# EAGLE design MirZ21 (EAGLE 9.6.2)
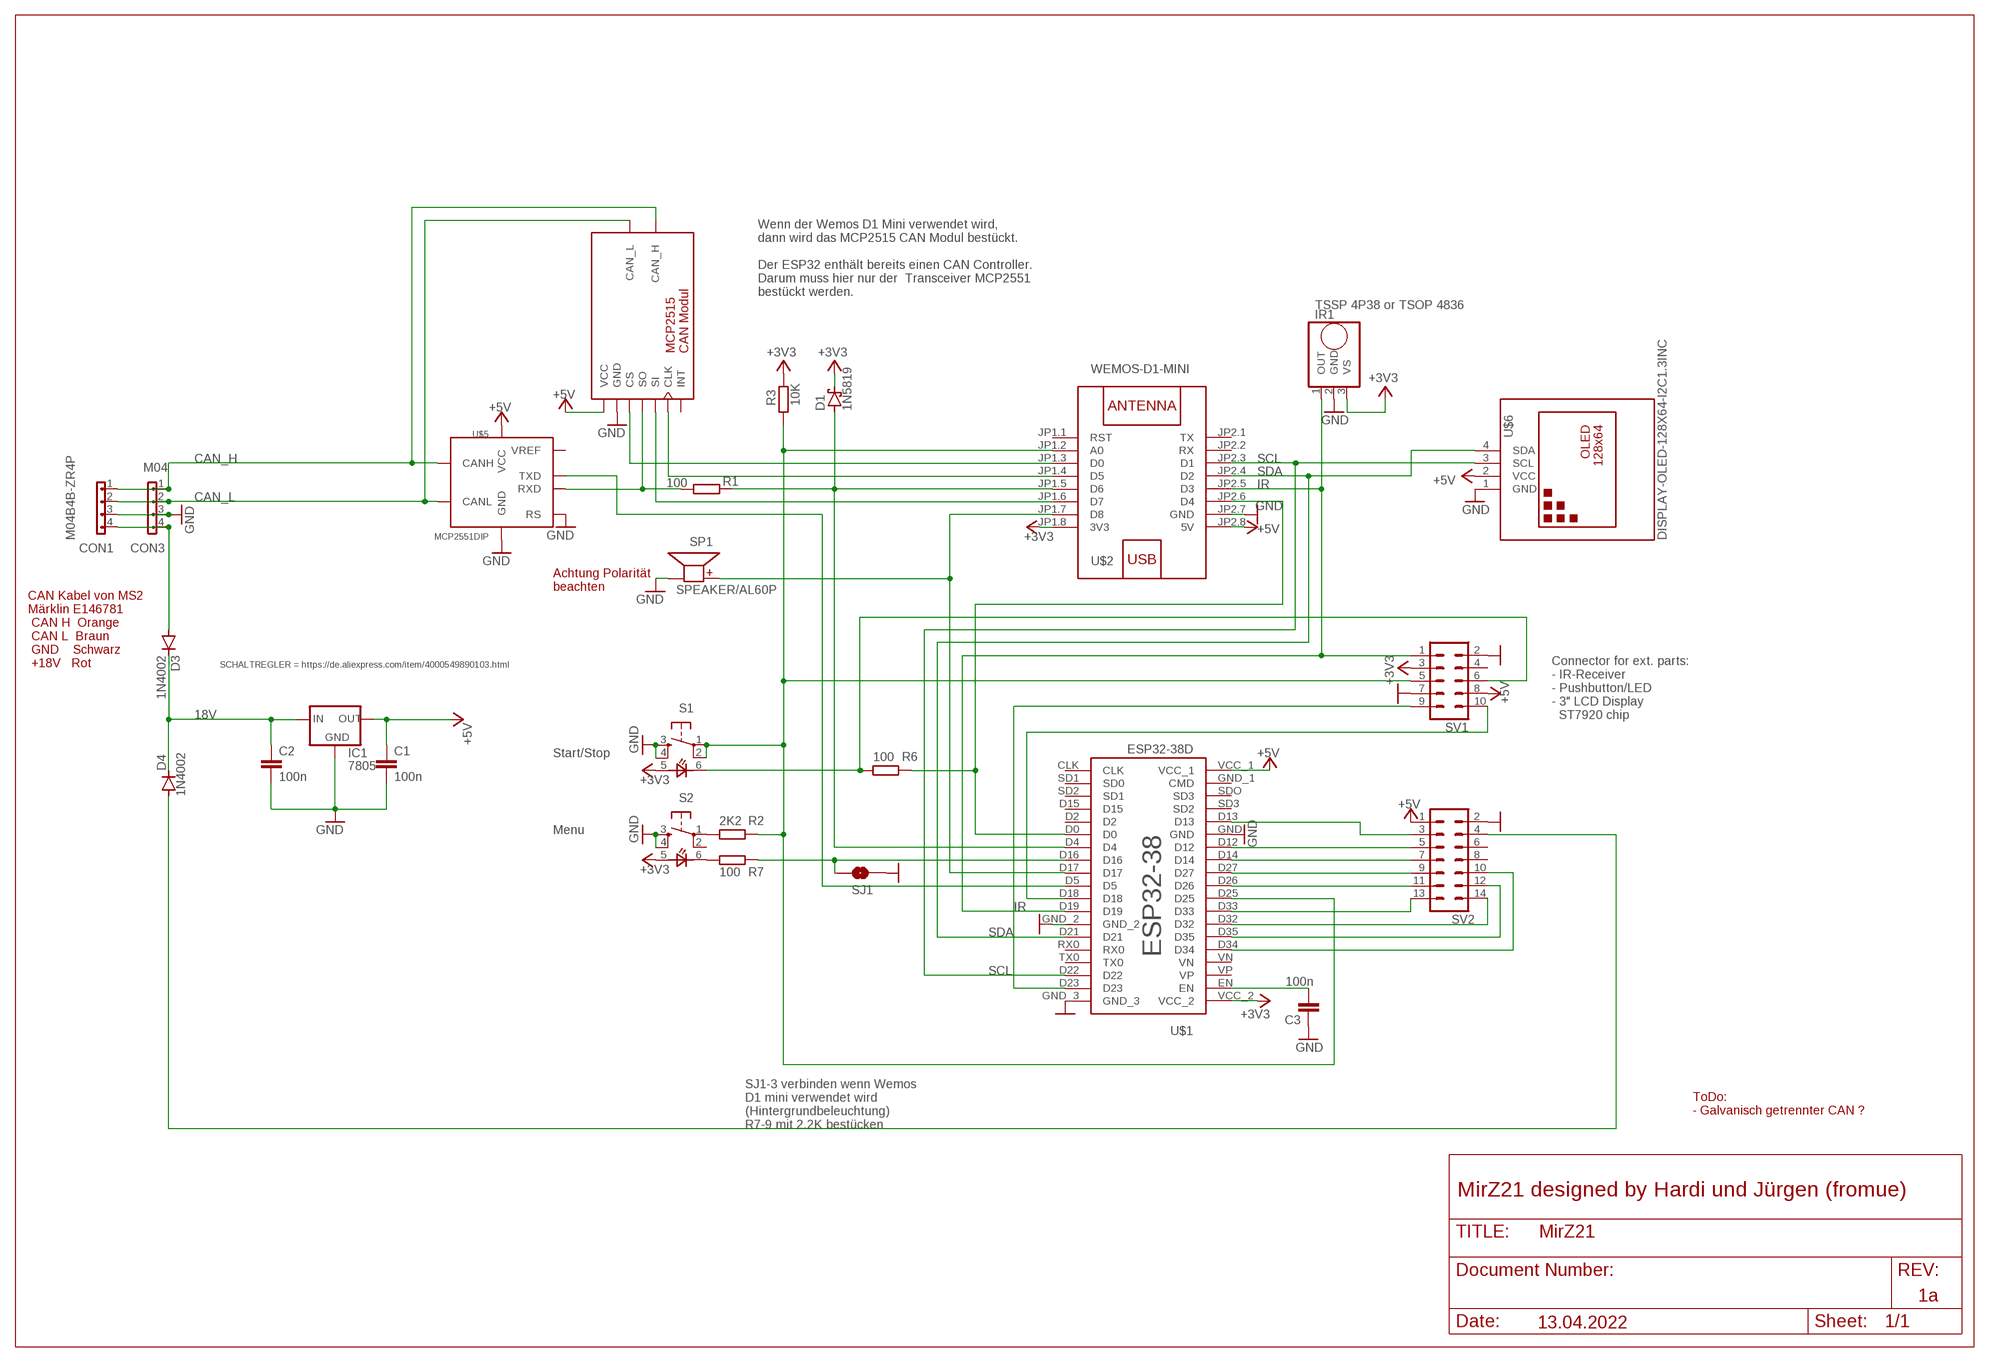
[diagram p0: schematic, sheet 1]

## Parts
C1  100n  C-EU025-025X050  [C025-025X050]
C2  100n  C-EU025-025X050  [C025-025X050]
C3  100n  C-EU025-025X050  [C025-025X050]
CAN1  MCP2515_CAN_CUTCUT  [MCP2515_CAN_CUT]
CON1  M04B4B-ZR4P  [B4B-ZR4P]
CON3  M04  [1X04]
D1  1N5819  1N581  [DO41-7.6]
D3  1N4002  1N4004  [DO41-10]
D4  1N4002  1N4004  [DO41-10]
IC1  7805  78XXSSTEPDOWN  [HX1314G]
IR1  TSSP 4P38 or TSOP 4836  TSSP4P38  [TSSP4P38]
R1  100  R0204/7  [0204/7]
R2  2K2  R0204/7  [0204/7]
R3  10K  R0204/7  [0204/7]
R6  100  R0204/7  [0204/7]
R7  100  R0204/7  [0204/7]
S1  TASTER_LEDTC-1198-B  [TASTER_LED]
S2  TASTER_LEDTC-1198-B  [TASTER_LED]
SJ1  SOLDERJUMPERNO  [SJ_2S-NO]
SP1  SPEAKER/AL60P  [RMP-14SP]
SV1  ML10  [ML10]
SV2  ML14  [ML14]
U$1  ESP32-38D  [ESP32-38D]
U$2  WEMOS-D1-MINI  [WEMOS-D1-MINI]
U$5  MCP2551DIP  [DIP08]
U$6  DISPLAY-OLED-128X64-I2C1.3INC  [DISPLAY-OLED-128X64-I2C-1.3]

## Nets
18V: C2.1 D3.C D4.C IC1.IN
+3V3: D1.C IR1.3(VS) R3.2 S1.5(+) S2.5(+) SV1.3 U$1.VCC_2 U$2.JP1.8(3V3)
+5V: C1.1 CAN1.1(VCC) IC1.OUT SV1.8 SV2.1 U$1.VCC_1 U$2.JP2.8(5V) U$5.3(VCC) U$6.2(VCC)
CAN_H: CAN1.9(CAN_H) CON1.1 CON3.1 U$5.7(CANH)
CAN_L: CAN1.8(CAN_L) CON1.2 CON3.2 U$5.6(CANL)
GND: C1.2 C2.2 C3.1 CAN1.2(GND) CON1.3 CON3.3 IC1.GND IR1.2(GND) S1.3(S) S1.4(S1) S2.3(S) S2.4(S1) SJ1.1 SP1.2(-) SV1.2 SV1.7 SV2.2 U$1.GND U$1.GND_2 U$1.GND_3 U$2.JP2.7(GND) U$5.2(GND) U$5.8(RS) U$6.1(GND)
IR: IR1.1(OUT) SV1.1 U$1.D19 U$2.JP2.5(D3)
N$1: CAN1.3(CS) U$2.JP1.3(D0)
N$2: CAN1.5(SI) U$2.JP1.6(D7)
N$3: D1.A R1.1 U$1.D4 U$2.JP1.5(D6)
N$4: R6.2 S1.6(-) SV1.6
N$5: CAN1.6(CLK) U$2.JP1.4(D5)
N$6: U$1.D5 U$5.1(TXD)
N$7: CAN1.4(SO) R1.2 U$5.4(RXD)
N$8: R7.2 S2.6(-)
N$9: C3.2 U$1.EN
N$10: R2.2 S2.1(P)
N$13: R6.1 U$1.D0 U$2.JP2.6(D4)
N$14: R2.1 R3.1 S1.1(P) S1.2(P1) SV1.5 U$1.D25 U$2.JP1.2(A0)
N$16: SP1.1(+) U$1.D17 U$2.JP1.7(D8)
N$20: R7.1 SJ1.2 U$1.D16
N$21: SV1.10 U$1.D18
N$22: SV1.9 U$1.D23
N$23: SV2.3 U$1.D13
N$24: SV2.5 U$1.D12
N$25: SV2.7 U$1.D14
N$26: SV2.9 U$1.D27
N$27: SV2.11 U$1.D26
N$28: SV2.13 U$1.D33
N$29: SV2.14 U$1.D32
N$30: SV2.12 U$1.D35
N$31: SV2.10 U$1.D34
N$34: D4.A SV2.4
N$35: CON1.4 CON3.4 D3.A
SCL: U$1.D22 U$2.JP2.3(D1) U$6.3(SCL)
SDA: U$1.D21 U$2.JP2.4(D2) U$6.4(SDA)
Unconnected: CAN1.7(INT) S2.2(P1) SV1.4 SV2.6 SV2.8 U$1.CLK U$1.D2 U$1.D15 U$1.GND_1(CMD) U$1.RX0 U$1.SD1(SD0) U$1.SD2(SD1) U$1.SD3(SD2) U$1.SDO(SD3) U$1.TX0 U$1.VN U$1.VP U$2.JP1.1(RST) U$2.JP2.1(TX) U$2.JP2.2(RX)

## Notes on the sheet
- Wenn der Wemos D1 Mini verwendet wird,
  dann wird das MCP2515 CAN Modul bestückt.
  
  Der ESP32 enthält bereits einen CAN Controller. 
  Darum muss hier nur der  Transceiver MCP2551
  bestückt werden.
- Achtung Polarität
  beachten
- CAN Kabel von MS2
  Märklin E146781
   CAN H  Orange   
   CAN L  Braun    
   GND    Schwarz  
   +18V   Rot
- Connector for ext. parts:
  - IR-Receiver
  - Pushbutton/LED
  - 3" LCD Display 
    ST7920 chip
- Start/Stop
- Menu
- SJ1-3 verbinden wenn Wemos
  D1 mini verwendet wird
  (Hintergrundbeleuchtung)
  R7-9 mit 2.2K bestücken
- ToDo:
  - Galvanisch getrennter CAN ?
- MirZ21 designed by Hardi und Jürgen (fromue)
- 1a
- 13.04.2022

## Power pins joined to a net without a drawn wire
VREF: U$5.5(VREF)

## Library data of the parts
C1-C3 = rcl:C-EU: CAPACITOR, European symbol
CAN1 = Arduino_fuer_LEDs_DCC_2_All:MCP2515_CAN_CUT: MCP2515 CAN Modul
CON1 CON3 = Connectors_Inline3_7:M04
D1 = diode:1N581*: 1.0A SCHOTTKY BARRIER RECTIFIER Source: http://www.diodes.com/datasheets/ds23001.pdf
D3 D4 = diode:1N4004: DIODE general purpose rectifier, 1 A
IC1 = v-reg:78XXS: VOLTAGE REGULATOR; SCHALTREGLER: https://de.aliexpress.com/item/4000549890103.html
IR1 = adafruit:TSSP4P38: TSSP 4P38
R1-R3 R6 R7 = Arduino_fuer_LEDs_DCC_2:R: RESISTOR, European symbol; SPICEMODEL: NONE; SPICEPREFIX: R
S1 S2 = switch-omron:TASTER_LED: OMRON SWITCH; ALI: https://de.aliexpress.com/item/4000415375387.html; ELV: 091576 EAN 4023392915765
SJ1 = SparkFun-Retired:SOLDERJUMPER: Solder Jumper Standard SMD solder jumper. Used to automate production. Two varients : Normally Open and Normally Closed are the same, but have different paste layers. NC will have a large amount of paste and should jumper during reflow.
SP1 = adafruit:SPEAKER: SPEAKER Source: Buerklin Added PS12 (for part # PS1240 piezo) http://www.ladyada.net/library/pcb/eaglelibrary.html
SV1 = con-harting-ml:ML10: HARTING; OC_FARNELL: unknown; OC_NEWARK: unknown
SV2 = Arduino_fuer_LEDs_DCC_2:ML14: HARTING; OC_FARNELL: unknown; OC_NEWARK: unknown
U$1 = MLL-Dominik-Hardi:ESP32-38
U$2 = diy-modules_modified_by_Hardi:WEMOS-D1-MINI: WEMOS D1 mini: Mini Wi-Fi Board based on ESP-8266 device More details can be found here: https://www.wemos.cc/product/d1-mini.html Click here to find device on ebay.com <http://www.ebay.com/sch/wemos+d1+mini+nodemcu>
U$5 = MLL-Dominik-Hardi:MCP2551
U$6 = diy-modules:DISPLAY-OLED-128X64-I2C: 128x64 Dot Matrix OLED Module based on SSD1306 chip Variant with I2C interface More details available here: http://www.instructables.com/id/Monochrome-096-i2c-OLED-display-with-arduino-SSD13/ SSD1306 datasheet: https://cdn-shop.adafruit.com/datasheets/SSD1306.pdf Click here to find device on ebay.com <http://www.ebay.com/sch/oled+display+128x64+iic> Note: There are two variants: I2C and SPI. Search for the proper version.

## Board
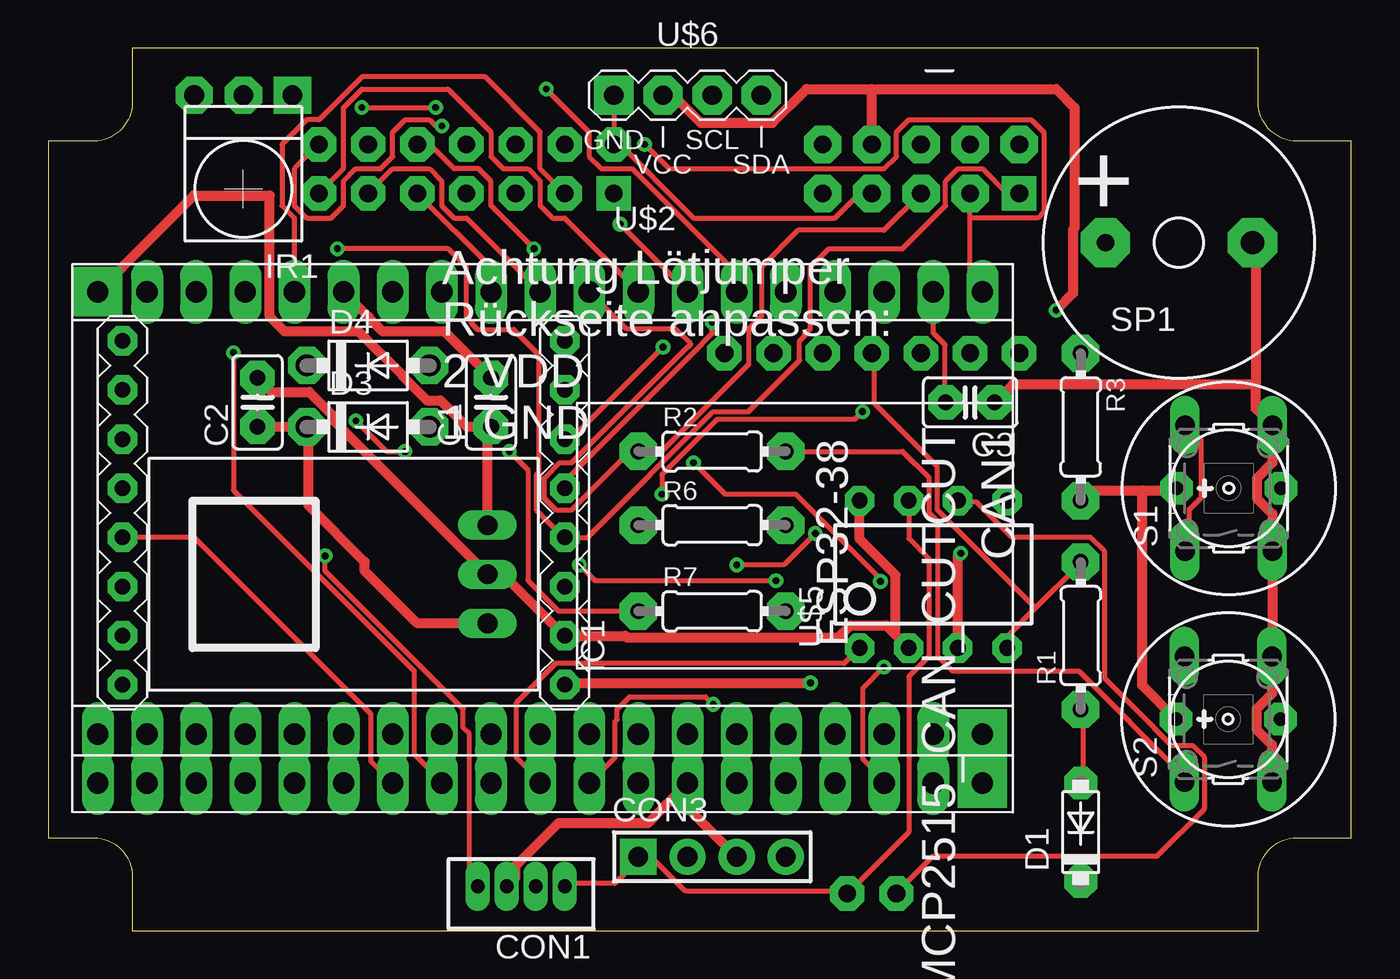
[diagram p1: board, top side]
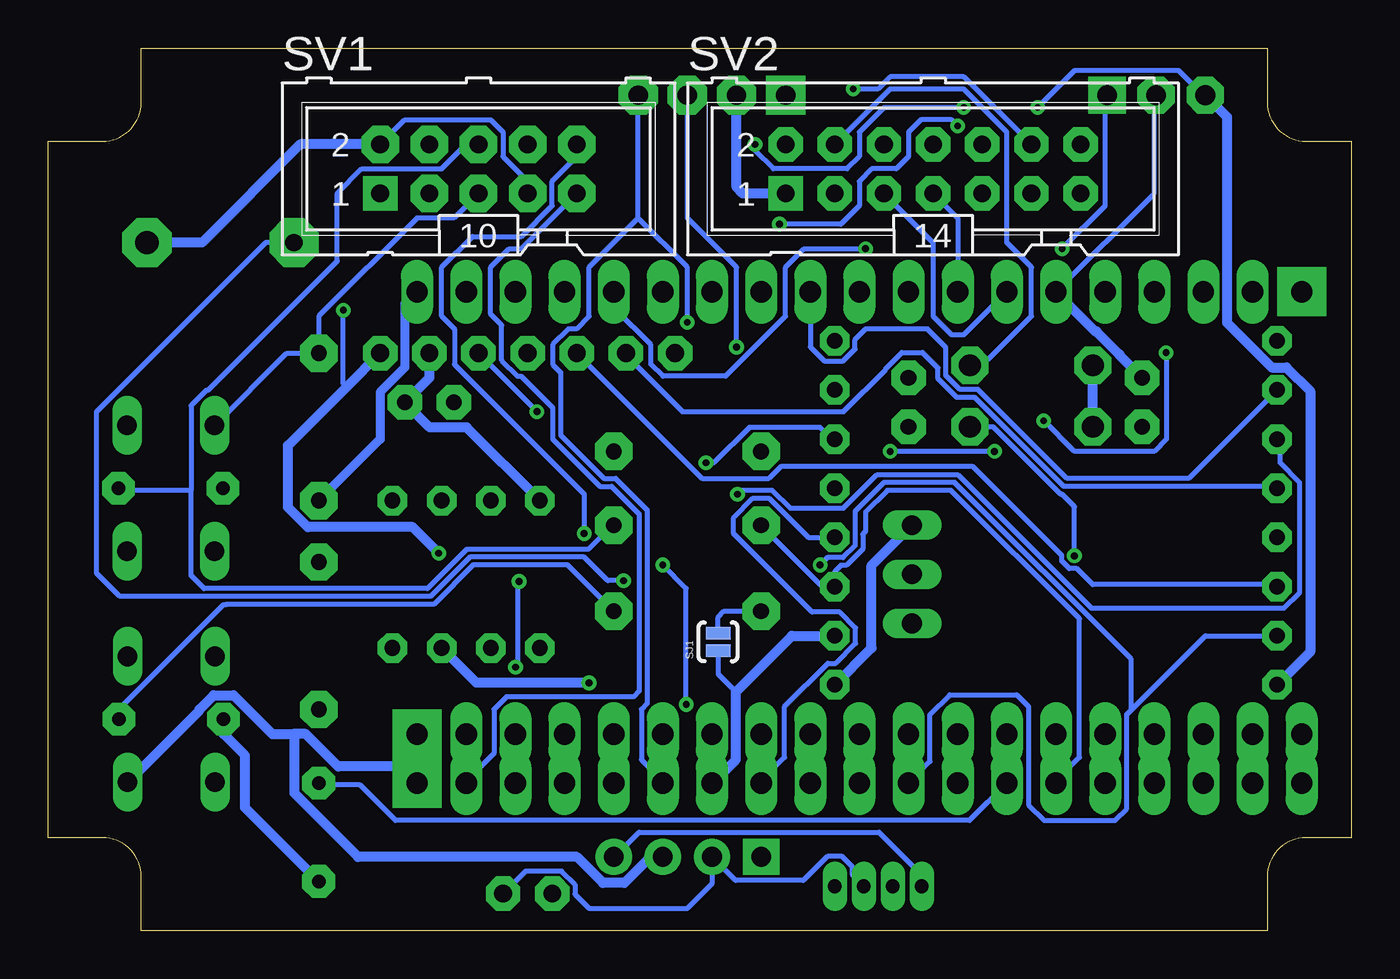
[diagram p2: board, bottom side, seen from below]

Size 67.33 x 45.6 mm. Coordinates in mm from the lower left corner, seen from the top.
Outline: 62.53,0 62.53,2.8 arc-90 64.53,4.8 67.33,4.8 67.33,40.8 64.53,40.8 arc-90 62.53,42.8 62.53,45.6 4.33,45.6 4.33,42.8 arc-90 2.33,40.8 0,40.8 0,4.8 2.33,4.8 arc-90 4.33,2.8 4.33,0 62.53,0
Copper layers (1*16): Top 0.035mm / dielectric 1.5mm / Bottom 0.035mm
Design rules "default *": minimum track width 6mil, minimum drill 0.35mm, track to track 6mil, track to pad 6mil, pad to pad 6mil, via to via 6mil, smd to smd 6mil, copper to edge 40mil, drill to drill 6mil, minimum pad ring 10mil, minimum via ring 8mil, stop-mask expansion 4mil, vias tented up to drill 0mil, thermal gap 10mil

### Footprints (pad centres in the part's own frame; a part is rotated, then mirrored left to right if it is on the bottom)
C025-025X050 = drill 0.813 pad 1.778 octagon: 1 -1.27,0; 2 1.27,0
MCP2515_CAN_CUT = drill 0.914 pad 1.778 octagon: 1 0,0; 2 0,-2.54; 3 0,-5.08; 4 0,-7.62; 5 0,-10.16; 6 0,-12.7; 7 0,-15.24; 8 27.94,-6.35; 9 27.94,-8.89
B4B-ZR4P = drill 0.7 pad 1.27 long: 1 0,0; 2 1.5,0; 3 3,0; 4 4.5,0
1X04 = drill 1.016 pad 1.88 square: 1 0,0 | drill 1.016 pad 1.88: 2 2.54,0; 3 5.08,0; 4 7.62,0
DO41-7.6 = drill 0.7 pad 1.7 octagon: A 2.54,0; C -2.54,0
DO41-10 = drill 1.118 pad 1.93 octagon: A 3.175,0; C -3.175,0
HX1314G = drill 1.016 long: GND 0,0; IN -2.54,0; OUT 2.54,0
TSSP4P38 = drill 1.016 pad 1.93 square: 1 -2.54,0 | drill 1.016 pad 1.93 octagon: 2 0,0; 3 2.54,0
0204/7 = drill 0.813 pad 1.93 octagon: 1 -3.81,0; 2 3.81,0
TASTER_LED = drill 1.016 long: 1 -3.251,2.261; 2 3.251,2.261; 3 -3.251,-2.261; 4 3.251,-2.261 | drill 0.7 pad 1.676 octagon: 5 0,2.7; 6 0,-2.7
SJ_2S-NO = smd 0.635 x 1.27: 1 -0.45,0; 2 0.45,0
RMP-14SP = drill 0.9 pad 2.54 octagon: 1 -3.8,0 | drill 1.2 pad 2.54 octagon: 2 3.8,0
ML10 = drill 0.914 pad 1.778 square: 1 -5.08,-1.27 | drill 0.914 pad 1.93 octagon: 2 -5.08,1.27; 3 -2.54,-1.27; 4 -2.54,1.27; 5 0,-1.27; 6 0,1.27; 7 2.54,-1.27; 8 2.54,1.27; 9 5.08,-1.27; 10 5.08,1.27
ML14 = drill 0.914 pad 1.778 square: 1 -7.62,-1.27 | drill 0.914 pad 1.778 octagon: 2 -7.62,1.27; 3 -5.08,-1.27; 4 -5.08,1.27; 5 -2.54,-1.27; 6 -2.54,1.27; 7 0,-1.27; 8 0,1.27; 9 2.54,-1.27; 10 2.54,1.27; 11 5.08,-1.27; 12 5.08,1.27; 13 7.62,-1.27; 14 7.62,1.27
ESP32-38D = drill 1.1 pad 1.45 long: CLK 25.4,0; CLK-1 22.86,0; D0 25.4,12.7; D0-1 22.86,12.7; D2 25.4,10.16; D2-0 22.86,10.16; D4 25.4,15.24; D4-1 22.86,15.24; D5 25.4,22.86; D5-1 22.86,22.86; D12 0,15.24; D13 0,10.16; D14 0,17.78; D15 25.4,7.62; D15-1 22.86,7.62; D16 25.4,17.78; D16-1 22.86,17.78; D17 25.4,20.32; D17-1 22.86,20.32; D18 25.4,25.4; D18-1 22.86,25.4; D19 25.4,27.94; D19-1 22.86,27.94; D21 25.4,33.02; D21-1 22.86,33.02; D22 25.4,40.64; D22-1 22.86,40.64; D23 25.4,43.18; D23-1 22.86,43.18; D25 0,25.4; D26 0,22.86; D27 0,20.32; D32 0,30.48; D33 0,27.94; D34 0,35.56; D35 0,33.02; EN 0,43.18; GND 0,12.7; GND_1 0,2.54; GND_2 25.4,30.48; GND_2-1 22.86,30.48; RX0 25.4,35.56; RX0-1 22.86,35.56; SD0-1 22.86,2.54; SD1 25.4,5.08; SD1-1 22.86,5.08; SD2 0,7.62; SD3 0,5.08; SDO 25.4,2.54; TX0 25.4,38.1; TX0-1 22.86,38.1; VCC_2 0,45.72; VN 0,38.1; VP 0,40.64 | drill 1.1 pad 2.54 square: GND_3 25.4,45.72; GND_3-1 22.86,45.72; VCC_1 0,0
WEMOS-D1-MINI = drill 0.8 pad 1.524 octagon: JP1.1 -11.43,9.525; JP1.2 -11.43,6.985; JP1.3 -11.43,4.445; JP1.4 -11.43,1.905; JP1.5 -11.43,-0.635; JP1.6 -11.43,-3.175; JP1.7 -11.43,-5.715; JP1.8 -11.43,-8.255; JP2.1 11.43,9.525; JP2.2 11.43,6.985; JP2.3 11.43,4.445; JP2.4 11.43,1.905; JP2.5 11.43,-0.635; JP2.6 11.43,-3.175; JP2.7 11.43,-5.715; JP2.8 11.43,-8.255
DIP08 = drill 0.813 pad 1.524 octagon: 1 -3.81,-3.81; 2 -1.27,-3.81; 3 1.27,-3.81; 4 3.81,-3.81; 5 3.81,3.81; 6 1.27,3.81; 7 -1.27,3.81; 8 -3.81,3.81
DISPLAY-OLED-128X64-I2C-1.3 = drill 1 pad 2.032 square: 1 -3.81,12.7 | drill 1 pad 2.032 octagon: 2 -1.27,12.7; 3 1.27,12.7; 4 3.81,12.7

### Placement (x,y rotation side)
C1  22.88,27.3 90 top
C2  10.81,27.3 90 top
C3  47.64,27.3 180 top
CAN1  50.18,29.84 270 top
CON1  26.69,2.29 180 top
CON3  30.5,3.81 0 top
D1  53.36,5.08 90 top
D3  16.53,26.04 0 top
D4  16.53,29.21 0 top
IC1  22.7,18.41 90 top
IR1  10.08,43.18 180 top
R1  53.36,15.24 90 top
R2  34.3,24.77 0 top
R3  53.36,26.04 270 top
R6  34.3,20.95 0 top
R7  34.3,16.51 0 top
S1  61,22.86 90 top
S2  60.98,10.92 90 top
SJ1  32.72,14.92 90 bottom
SP1  58.44,35.56 0 top
SV1  45.1,39.37 0 bottom
SV2  21.61,39.37 0 bottom
U$1  2.56,33.02 270 top
U$2  15.26,20.95 0 top
U$5  45.73,18.41 0 top
U$6  33.04,30.48 0 top

### Tracks (layer width: path | path; a pad name or v marks a point on that pad's centre or on a via)
18V
  Top 0.508: IC1.IN 19.07,15.88 16.36,18.58 16.36,19.06 13.43,21.99 13.43,26.01 13.4,26.04 D3.C C2.1
  Bottom 0.508: D3.C D4.C
+3V3  (via drill 0.35)
  Top 0.254: 57.48,22.76 57.52,22.76 | 57.52,22.76 58.13,22.76 S1.5 57.52,22.76 | 47.64,36.83 47.64,33.66 U$1.VCC_2 | 47.64,36.83 SV1.3 | 47.64,36.83 51.13,36.83 51.45,37.15 51.45,41.27 50.81,41.91 44.47,41.91 43.83,41.27 43.83,40.01 43.2,39.37 32.08,39.37 v30.81,40.64 | v16.21,42.55 v20.02,42.55
  Top 0.508: R3.2 53.89,22.76 56.53,22.76 | 56.53,22.76 57.48,22.76 58.2,22.76 S1.5 | S2.5 56.53,12.67 56.53,22.76
  Bottom 0.254: v30.81,40.64 30.81,40.32 29.86,39.37 26.05,39.37 25.41,40.01 25.41,41.27 24.14,42.55 v20.02,42.55 | v16.21,42.55 14.3,44.45 8.91,44.45 7.63,43.18 IR1.3
  Bottom 0.457: U$1.VCC_2 48.91,32.38 48.91,29.1 50.18,27.83 50.18,25.4 R3.2
  Bottom 0.508: S2.5 58.27,10.16 57.16,9.05 57.16,6.35 D1.C | IR1.3 6.4,42.05 6.4,31.41 4.11,29.11 3.34,29.11 2.12,27.89 2.12,14.4 U$2.JP1.8
+5V  (via drill 0.35)
  Top 0.508: U$2.JP2.8 26.79,12.8 v39.38,12.8 | IC1.OUT 22.7,25.86 C1.1 21.64,26.04 20.27,27.41 19.56,27.41 18.33,28.64 18.33,28.68 16.04,30.96 12.21,30.96 11.45,31.72 11.45,38 7.51,38 3.86,34.35 3.86,34.33 U$1.VCC_1 | U$5.3 47.01,19.36 v47.16,19.51 | U$6.2 32.29,43.18 33.72,41.76 37.43,41.76 39.17,43.5 42.56,43.5 | 42.56,43.5 52.09,43.5 53.04,42.55 53.04,36.33 52.96,36.25 52.96,32.94 v52.09,32.07 | SV1.8 42.56,43.5
  Bottom 0.254: v52.09,32.07 52.09,28.26 51.93,28.1
  Bottom 0.508: v39.38,12.8 45.2,12.8 U$5.3 | U$2.JP2.8 24.78,14.61 24.78,18.87 IC1.OUT | v47.16,19.51 48.5,20.85 53.92,20.85 54.94,21.87 54.94,25.08 51.93,28.1 CAN1.1 | SV2.1 31.45,38.1 31.77,38.42 U$6.2
CAN_H
  Top 0.254: 30.5,3.66 29.28,2.44 26.84,2.44 CON1.1 | 30.5,3.66 31.31,3.66 32.93,2.03 41.27,2.03 CAN1.9 44.47,5.08 44.47,13.13 45.51,14.17 45.51,19.22 44.47,20.26 U$5.7 | 30.5,3.66 CON3.1
CAN_L
  Top 0.254: U$5.6 47.16,22.15 47.97,22.15 49.8,20.32 53.86,20.32 54.6,19.58 54.6,13.04 57.16,10.48 57.16,10.46 58.07,9.55 59.15,9.55 59.76,8.94 59.76,6.3 57.32,3.86 45.73,3.86 43.91,2.03 CAN1.8
  Bottom 0.254: CON1.2 25.77,2.87 25.77,3.3 26.31,3.83 27.06,3.83 28.31,2.59 31.82,2.59 CON3.2 33.04,2.41 34.3,1.14 39.38,1.14 40.12,1.88 40.12,2.39 40.81,3.07 42.66,3.07 CAN1.8
GND
  Top 0.254: U$6.1 29.23,40.96 | SV1.7 41.92,38.1 40.66,36.83 33.35,36.83 29.23,40.96 | 29.23,40.96 SV2.2
  Top 0.508: CON1.3 24.14,2.75 24.14,3.35 26.36,5.56 31,5.56 31.73,6.29 31.73,6.31 32.32,6.91 | CON3.3 32.48,6.91 32.32,6.91 | U$1.GND_2 32.32,6.91 | C2.2 11.55,27.84 13.49,27.84 14.72,26.6 14.72,26.39 IC1.GND 23.51,18.41 U$2.JP2.7 29.82,15.24 29.93,15.14 40.81,15.14 41.44,15.77 43.3,15.77 U$5.2 43.79,15.28 43.79,18.37 41.92,20.24 U$5.8 | SP1.2 62.4,35.4 62.4,28.26 | 62.4,28.26 62.4,26.98 S1.4 63.27,24.18 62.46,23.38 62.46,22.34 63.27,21.54 S1.3 63.27,14.2 S2.4 63.24,12.24 62.43,11.44 62.43,10.41 63.24,9.6 S2.3 | C1.2 20.49,30.96 17.29,30.96 16.56,31.68 16.56,31.71 U$1.GND | C3.1 49.86,28.26 62.4,28.26
  Bottom 0.254: 15.26,32.92 U$1.GND 10.18,38.1 10.18,43.18 IR1.2 | SV1.7 42.56,38.73 43.83,40.01 43.83,41.27 44.47,41.91 48.91,41.91 SV1.2 | 31.8,12.34 32.72,13.26 SJ1.1
  Bottom 0.508: U$1.GND_2 32.55,8.1 32.52,8.1 31.8,8.82 31.8,12.34 28.91,15.24 U$2.JP2.7 | U$5.8 45.71,26.01 47.62,26.01 C3.1 47.64,28.57 CAN1.2 | 54.68,10.16 55.75,10.16 57.76,12.17 58.79,12.17 59.52,11.44 59.52,11.39 S2.3 | CON3.3 36.21,3.81 37.56,2.46 38.67,2.46 40.02,3.81 51.32,3.81 54.61,7.1 54.61,10.1 54.68,10.16 | 54.68,10.16 54.02,10.16 52.35,8.48 49.14,8.48 U$1.GND_3 | C2.2 11.98,29.74 11.98,29.78 13.16,30.96 13.23,30.96 15.18,32.92 15.26,32.92 | SV1.2 54.31,40.64 59.39,35.56 SP1.2
IR  (via drill 0.35)
  Top 0.254: SV1.1 49.55,38.1 48.27,39.37 47.01,39.37 46.37,38.73 46.37,37.47 44.15,35.24 40.34,35.24 39.38,34.29 39.38,31.11 39.07,30.8 39.11,30.76 38.83,30.48 38.83,29.46 36.19,26.82 34.36,26.82 27.85,20.32 U$2.JP2.5 26.63,20.32 25.21,21.74 25.21,23.54 25.34,23.67 25.34,29.77 24.05,31.06 22.19,31.06 21.87,31.38 21.92,31.43 21.61,31.75 21.61,34.29 20.65,35.24 v14.94,35.24
  Bottom 0.254: U$2.JP2.5 28.06,20.32 30.09,22.35 30.9,22.35 31.92,21.34 31.92,20.52 27.85,16.46 26.43,16.46 25.62,15.65 25.62,14.83 26.63,13.82 27.04,13.82 29.28,11.58 29.28,8.94 30.5,7.72 U$1.D19 | v14.94,35.24 12.71,37.47 12.71,43.18 IR1.1
N$1  (via drill 0.35)
  Top 0.254: v31.71,22.55 31.71,23.57 34.56,26.42 41.67,26.42 v42.08,26.82
  Bottom 0.254: v31.71,22.55 31.51,22.76 29.92,22.76 28.98,21.82 26.25,21.82 24.5,23.57 20.34,23.57 13.43,16.66 3.47,16.66 2.66,17.48 2.66,23.16 3.67,24.18 3.67,25.4 U$2.JP1.3 | CAN1.3 v42.08,26.82
N$2
  Bottom 0.254: CAN1.5 33.54,23.37 30.09,23.37 29.48,23.98 19.55,23.98 14.96,19.39 14.96,19.09 14.58,18.71 14.18,18.71 13.35,17.88 3.88,17.88 U$2.JP1.6
N$3
  Top 0.254: D1.A 53.46,7.72 53.46,11.38 R1.1 | U$2.JP1.5 7.53,20.32 16.68,11.18 16.68,8.74 U$1.D4
  Bottom 0.254: U$1.D4 19.73,5.69 49.39,5.69 51.22,7.52 53.25,7.52 D1.A
N$4
  Bottom 0.254: 59.96,22.76 63.62,22.76 S1.6 | R6.2 38.22,20.93 39.44,19.71 45.71,19.71 47.74,17.68 59.29,17.68 59.96,18.35 59.96,22.76 | 59.96,22.76 59.96,27.13 59.17,27.91 59.09,27.91 52.4,34.61 52.4,38.1 51.13,39.37 47.01,39.37 45.73,40.64 SV1.6
N$5
  Bottom 0.254: U$2.JP1.4 3.88,22.96 14.85,22.96 19.45,27.56 20.38,27.56 21.35,28.53 21.35,29.08 22.14,29.88 23.23,29.88 24.04,29.06 24.04,29.01 26.23,26.82 34.56,26.82 37.4,29.67 CAN1.6
N$6
  Top 0.254: U$1.D5 25.41,7.72 24.2,8.94 24.2,11.79 26.21,13.8 41.12,13.8 U$5.1
N$7
  Top 0.254: 51.02,16.66 53.25,18.9 R1.2 | 51.02,16.66 49.6,15.24 49.6,14.63 U$5.4 | 51.02,16.66 45.94,21.74 45.94,23.98 42.69,27.23 42.69,29.67 CAN1.4
N$8
  Bottom 0.254: S2.6 63.67,11.45 58.28,16.85 58.14,16.85 58.12,16.87 47.41,16.87 45.37,18.9 40.5,18.9 R7.2
N$9
  Top 0.254: U$1.EN 45.73,30.89 46.34,30.28 46.34,27.43 C3.2
N$10
  Top 0.254: S2.1 58.54,7.72 58.54,8.13 53.25,13.41 46.73,13.41 45.96,14.17 45.96,21.14 45.53,21.57 45.53,23.38 44.15,24.77 R2.2
N$13
  Bottom 0.254: R6.1 30.5,20.93 27.45,17.88 26.84,17.88 U$2.JP2.6 26.69,18.55 26.37,18.87 26.09,18.87 25.24,19.72 25.24,20.5 25.1,20.64 25.1,21.64 23.98,22.76 20.67,22.76 14.04,16.12 14.04,8.94 15.26,7.72 U$1.D0
N$14
  Top 0.254: S1.1 58.94,19.71 58.94,21.74 59.55,22.35 59.55,25.4 58.94,26.01 S1.2 | SV1.5 43.2,36.2 38.75,36.2 36.84,34.29 36.84,31.75 36.19,31.09 36.19,29.26 31.71,24.79 30.5,24.79 R2.1 30.5,24.59 29.89,24.59 27.04,21.74 26.23,21.74 25.62,22.35 25.62,23.37 26.43,24.18 27.04,24.18 33.02,30.16 33.06,30.16 33.2,30.31 32.42,31.09 29.88,31.09 U$1.D25
  Bottom 0.254: U$2.JP1.2 8.4,23.37 14.68,23.37 19.28,27.96 20.22,27.96 20.95,28.69 20.95,30.14 21.9,31.09 25.1,31.09 25.64,30.54 25.64,30.05 26.25,29.44 27.23,29.44 27.96,30.16 U$1.D25 | S1.2 55.01,29.84 R3.1 53.36,31.75 48.27,36.83 46.37,36.83 SV1.5
N$16  (via drill 0.35)
  Top 0.254: v37.61,18.09 28.26,18.09 v27.45,18.9
  Bottom 0.254: U$2.JP1.7 7.53,15.24 11.39,11.38 | 11.39,11.38 11.6,11.18 11.6,6.3 12.21,5.69 15.87,5.69 16.68,6.5 16.68,11.58 17.29,12.19 20.74,12.19 21.76,11.18 21.76,8.74 U$1.D17 | v37.61,18.09 38.42,18.09 39.64,19.3 45.54,19.3 47.57,17.27 63.64,17.27 64.84,18.47 64.84,26.82 56.1,35.56 SP1.1 | v27.45,18.9 27.07,19.28 26.25,19.28 25.64,19.89 25.64,21.67 24.14,23.16 20.5,23.16 11.39,14.06 11.39,11.38
N$20  (via drill 0.35)
  Top 0.254: v9.57,29.87 9.57,22.76 18.91,13.41 18.91,9.14 20.34,7.72 U$1.D16 | R7.1 26.37,16.51 24.78,18.1 24.78,23.81 v23.83,24.77 | v18.43,24.77 17.48,24.77 v15.89,26.35
  Bottom 0.254: v18.43,24.77 v23.83,24.77 | v15.89,26.35 14.3,24.77 10.18,24.77 9.54,25.4 9.54,29.84 v9.57,29.87 | R7.1 32.4,16.51 32.72,16.19 SJ1.2
N$21  (via drill 0.35)
  Top 0.254: U$1.D18 29.28,8.94 29.28,10.79 29.39,10.91 29.39,11.44 30.04,12.09 33.96,12.09 v34.36,11.69 | v35.58,18.9 38.01,18.9 v39.64,20.52
  Bottom 0.254: v39.64,20.52 39.64,22.55 46.34,29.26 46.34,31.09 47.01,31.75 47.01,34.29 45.42,35.88 42.88,35.88 41.29,37.47 41.29,38.73 40.02,40.01 SV1.10 | v34.36,11.69 34.36,17.68 v35.58,18.9
N$22
  Bottom 0.254: U$1.D23 45.73,7.72 44.3,9.16 44.3,11.44 43.65,12.09 37.09,12.09 36.79,12.38 36.79,21.54 38.22,22.96 38.83,22.96 41.27,25.4 41.27,27.03 42.89,28.65 43.09,28.65 43.91,29.46 43.91,31.29 44.47,31.85 44.47,34.29 43.51,35.24 42.88,35.24 SV1.9
N$23
  Top 0.254: U$1.D13 12.71,36.83 12.08,37.47 12.08,40.64 13.35,41.91 13.99,41.91 16.21,44.13 22.56,44.13 25.41,41.27 25.41,39.37 SV2.3
N$24
  Bottom 0.254: U$1.D12 20.02,30.8 20.65,30.8 21.61,31.75 21.61,35.56 SV2.5
N$25
  Bottom 0.254: U$1.D14 20.34,36.83 SV2.7
N$26
  Top 0.254: U$1.D27 22.88,34.29 SV2.9
N$27
  Top 0.254: U$1.D26 21.61,36.83 20.97,36.83 20.34,37.47 20.34,38.73 19.7,39.37 17.8,39.37 SV2.11
N$28
  Top 0.254: U$1.D33 26.69,36.83 26.05,36.83 25.41,37.47 25.41,38.73 24.78,39.37 23.51,39.37 22.88,40.01 22.88,41.27 20.65,43.5 16.21,43.5 15.26,42.55 15.26,39.37 SV2.13
N$29  (via drill 0.35)
  Top 0.254: v29.54,36.51 U$1.D32 | v20.34,41.59 20.02,41.59 19.7,41.91 18.43,41.91 17.8,41.27 17.8,40.01 17.16,39.37 15.89,39.37 15.26,38.73 15.26,37.47 14.62,36.83 13.35,36.83 12.71,37.47 12.71,39.37 SV2.14
  Bottom 0.254: v29.54,36.51 26.37,36.51 25.41,37.47 25.41,38.73 24.78,39.37 23.51,39.37 22.88,40.01 22.88,41.27 22.24,41.91 20.65,41.91 v20.34,41.59
N$30  (via drill 0.35)
  Top 0.254: U$1.D35 35.58,33.97 30.18,39.37 28.59,39.37 27.96,40.01 27.96,41.27 v25.73,43.5
  Bottom 0.254: v25.73,43.5 24.46,43.5 23.83,44.13 20.02,44.13 SV2.12
N$31  (via drill 0.35)
  Top 0.254: SV2.10 19.7,40.64 20.97,39.37 22.24,39.37 22.88,38.73 22.88,37.47 v25.1,35.24
  Bottom 0.254: U$1.D34 38.01,32.92 38.01,32.11 36.19,30.28 36.19,29.26 35.58,28.65 32.32,28.65 29.23,31.75 29.23,34.29 28.27,35.24 v25.1,35.24
N$34
  Bottom 0.254: SV2.4 23.83,43.5 20.02,43.5 17.8,41.27 17.8,35.56 16.53,34.29 16.53,31.75 18.75,29.53 19.38,29.53 D4.A
N$35  (via drill 0.35)
  Top 0.254: CON1.4 22.16,2.44 21.76,2.85 21.76,10.16 21.44,10.48 21.44,11.46 14.3,18.6 v14.3,19.37
  Bottom 0.254: CON1.4 22.37,2.44 22.37,3.05 24.4,5.08 36.79,5.08 38.01,3.86 CON3.4 | v14.3,19.37 14.3,21.91 14.95,22.55 15.02,22.55 18.5,26.04 D3.A
SCL  (via drill 0.35)
  Top 0.254: v43,18.05 43,18.17 38.62,22.55 34.97,22.55 v33.34,24.18 | U$1.D22 43.2,7.77 42.09,8.88 42.09,12.52 v43.18,13.61 | U$2.JP2.3 27,25.4 v31.77,30.16
  Bottom 0.254: v43.18,13.61 43.09,13.7 43.09,17.96 v43,18.05 | v33.34,24.18 32.93,24.18 31.11,26.01 27.45,26.01 26.84,25.4 U$2.JP2.3 | U$6.3 34.3,36.83 31.77,34.29 v31.77,30.16
SDA  (via drill 0.35)
  Top 0.254: U$2.JP2.4 26.84,22.96 26.84,23.37 33.77,30.3 33.77,30.33 34.3,30.86 v34.3,31.43
  Bottom 0.254: U$1.D21 35.58,7.72 36.68,8.83 36.68,11.44 36.39,11.73 36.39,21.74 38.01,23.37 38.62,23.37 40.86,25.6 40.86,28.85 41.27,29.26 41.27,30.28 40.45,31.09 40.05,31.09 39.38,31.75 39.38,34.29 36.84,36.83 | 36.84,36.83 U$6.4 | 36.84,36.83 34.3,34.29 v34.3,31.43